# Altium schematic sheet RCNetwork.SchDoc
size A4; DocumentNumber: 3; SheetNumber: 3; SheetTotal: 4
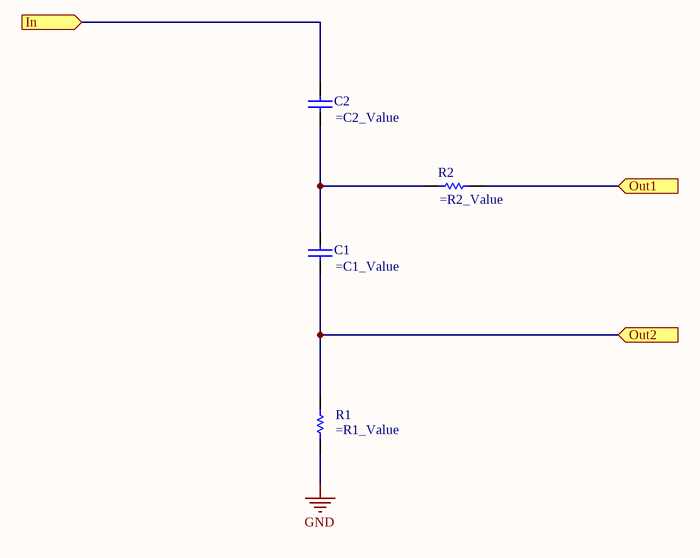
[diagram p0: RCNetwork.SchDoc]

## Parts
C1  (no value)  [C1206]
C2  (no value)  [C1206]
R1  (no value)  [3216[1206]]
R2  (no value)  [3216[1206]]

## Ports
In (in), Out1 (in), Out2 (in)

## Nets
GND: R1.1
In: C2.1 ; port In
Out1: R2.1 ; port Out1
Out2: C1.2 R1.2 ; port Out2
NetC1_1: C1.1 C2.2 R2.2

## Notes on the sheet
- Title
- Size:
- Date:
- A4
- Number:
- Time:
- Revision:
- Sheet
- of
- File:

## Library data of the parts
C1 C2 = Cap: Capacitor; Published: 8-Jun-2000; LatestRevisionDate: 17-Jul-2002; LatestRevisionNote: Re-released for DXP Platform.; Publisher: Altium Limited
  C1: Value: =C1_Value
  C2: Value: =C2_Value
R1 R2 = Res1: Resistor; Published: 8-Jun-2000; LatestRevisionDate: 17-Jul-2002; LatestRevisionNote: Re-released for DXP Platform.; Publisher: Altium Limited
  R1: Value: =R1_Value
  R2: Value: =R2_Value